# Altium project CMRat_GEN2.8.PrjPcb (part 2 of 2)

## Sheet PBC.SchDoc: =filename
size A4
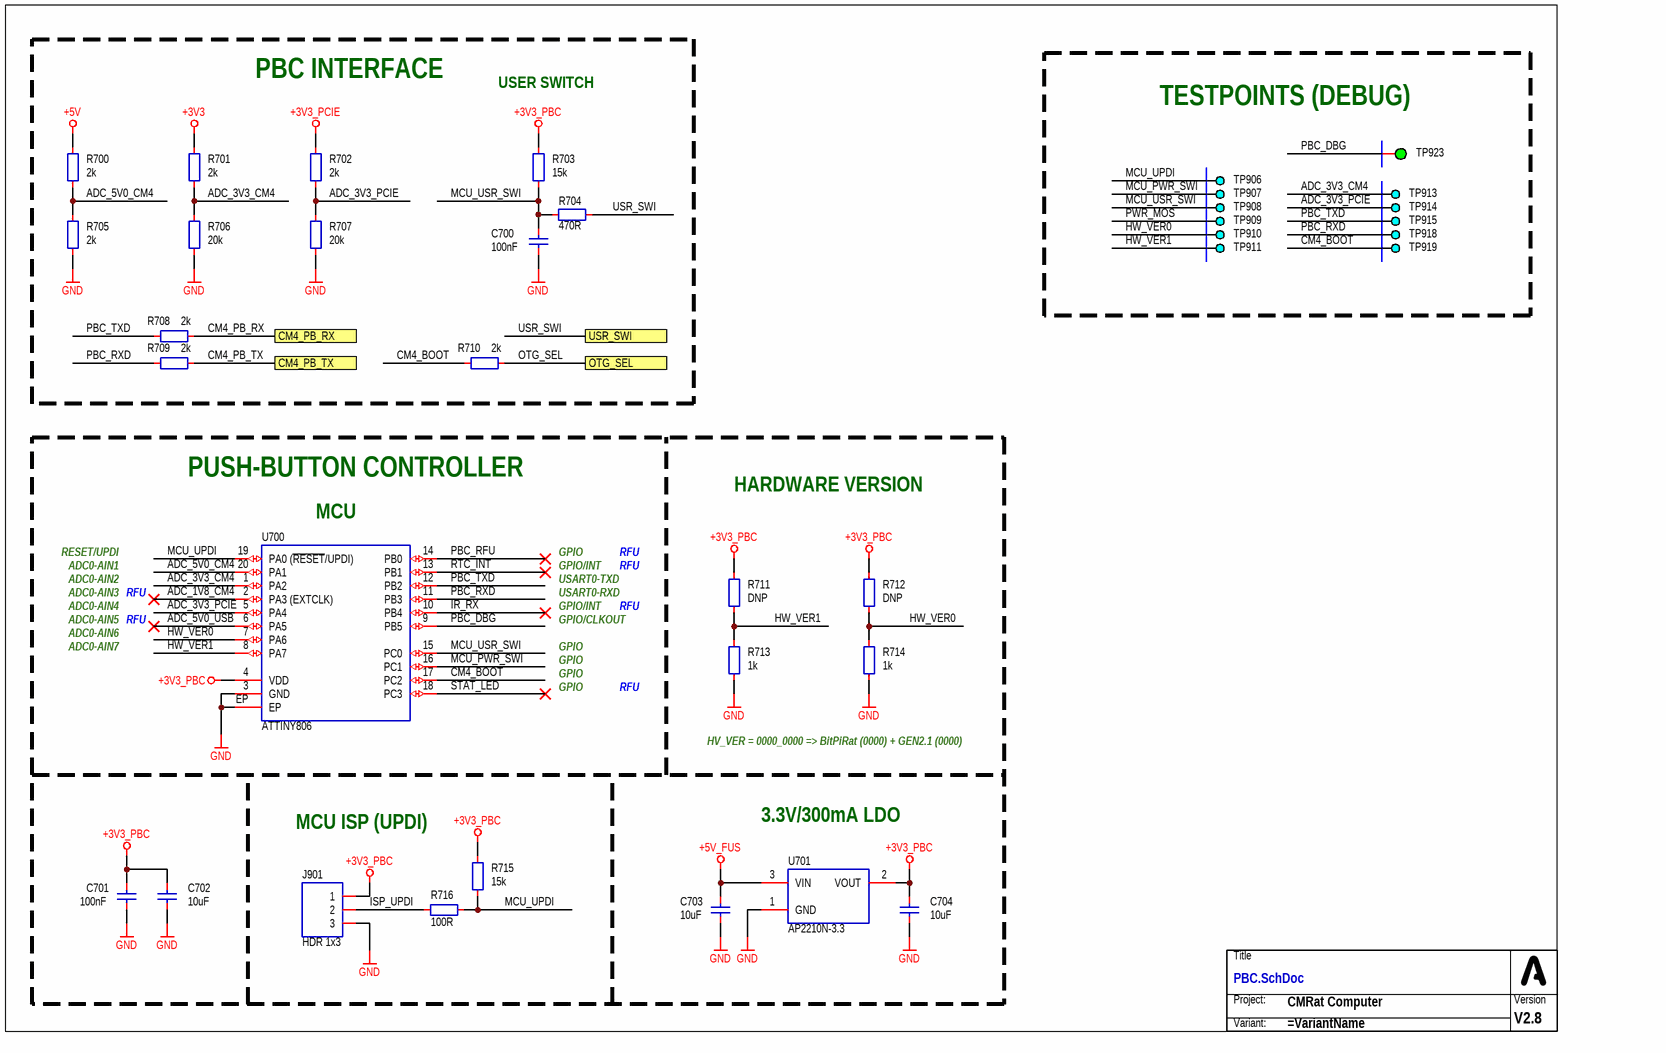
[diagram p10: PBC.SchDoc]

### Parts
C700  100nF  [CAP_0603_R]
C701  100nF  [CAP_0603_R]
C702  10uF  [CAP_0603_R]
C703  10uF  [CAP_0603_R]
C704  10uF  [CAP_0603_R]
J901  HDR 1x3  [CON_HDR_P254_1X03_STR]
R700  2k  [RES_0603_R]
R701  2k  [RES_0603_R]
R702  2k  [RES_0603_R]
R703  15k  [RES_0603_R]
R704  470R  [RES_0603_R]
R705  2k  [RES_0603_R]
R706  20k  [RES_0603_R]
R707  20k  [RES_0603_R]
R708  2k  [RES_0603_R]
R709  2k  [RES_0603_R]
R710  2k  [RES_0603_R]
R711  DNP  [RES_0603_R]
R712  DNP  [RES_0603_R]
R713  1k  [RES_0603_R]
R714  1k  [RES_0603_R]
R715  15k  [RES_0603_R]
R716  100R  [RES_0603_R]
TB700  (no value)  (no BOM)
TP906  DEBUG  [PCB_TP_DBG_50]  (value not drawn)  (no BOM)
TP907  DEBUG  [PCB_TP_DBG_50]  (value not drawn)  (no BOM)
TP908  DEBUG  [PCB_TP_DBG_50]  (value not drawn)  (no BOM)
TP909  DEBUG  [PCB_TP_DBG_50]  (value not drawn)  (no BOM)
TP910  DEBUG  [PCB_TP_DBG_50]  (value not drawn)  (no BOM)
TP911  DEBUG  [PCB_TP_DBG_50]  (value not drawn)  (no BOM)
TP913  DEBUG  [PCB_TP_DBG_50]  (value not drawn)  (no BOM)
TP914  DEBUG  [PCB_TP_DBG_50]  (value not drawn)  (no BOM)
TP915  DEBUG  [PCB_TP_DBG_50]  (value not drawn)  (no BOM)
TP918  DEBUG  [PCB_TP_DBG_50]  (value not drawn)  (no BOM)
TP919  DEBUG  [PCB_TP_DBG_50]  (value not drawn)  (no BOM)
TP923  ICT  [PCB_TP_ICT_100]  (value not drawn)  (no BOM)
U700  ATTINY806  [ICC_QFN20_300X300X90_P40_EP_R]
U701  AP2210N-3.3  [PKG_SOT23-3L_SC59_P190_R]

### Ports
CM4_PB_RX, CM4_PB_TX, OTG_SEL, USR_SWI

### Nets
+3V3: R701.1
+3V3_PBC: C701.2 C702.2 C704.2 J901.1 R703.2 R711.2 R712.2 R715.2 U700.4(VDD) U701.2(VOUT)
+3V3_PCIE: R702.1
+5V: R700.1
+5V_FUS: C703.2 U701.3(VIN)
GND: C700.1 C701.1 C702.1 C703.1 C704.1 J901.3 R705.2 R706.1 R707.1 R713.1 R714.1 U700.3(GND) U700.EP U701.1(GND)
ADC_1V8_CM4: U700.2(PA3_(EXTCLK))
ADC_3V3_CM4: R701.2 R706.2 TP913.1 U700.1(PA2)
ADC_3V3_PCIE: R702.2 R707.2 TP914.1 U700.5(PA4)
ADC_5V0_CM4: R700.2 R705.1 U700.20(PA1)
ADC_5V0_USB: U700.6(PA5)
CM4_BOOT: R710.2 TP919.1 U700.17(PC2)
CM4_PB_RX: R708.2 ; port CM4_PB_RX
CM4_PB_TX: R709.2 ; port CM4_PB_TX
HW_VER0: R712.1 R714.2 TP910.1 U700.7(PA6)
HW_VER1: R711.1 R713.2 TP911.1 U700.8(PA7)
IR_RX: U700.10(PB4)
ISP_UPDI: J901.2 R716.1
MCU_PWR_SWI: TP907.1 U700.16(PC1)
MCU_UPDI: R715.1 R716.2 TP906.1 U700.19(PA0_(~{RESET}/UPDI))
MCU_USR_SWI: C700.2 R703.1 R704.2 TP908.1 U700.15(PC0)
OTG_SEL: R710.1 ; port OTG_SEL
PBC_DBG: TP923.1 U700.9(PB5)
PBC_RFU: U700.14(PB0)
PBC_RXD: R709.1 TP918.1 U700.11(PB3)
PBC_TXD: R708.1 TP915.1 U700.12(PB2)
PWR_MOS: TP909.1
RTC_INT: U700.13(PB1)
STAT_LED: U700.18(PC3)
USR_SWI: R704.1 ; port USR_SWI

### Notes on the sheet
- PBC INTERFACE
- USER SWITCH
- (near TP923) TESTPOINTS (DEBUG)
- PUSH-BUTTON CONTROLLER
- (near U700) MCU
- HARDWARE VERSION
- RESET/UPDI
- ADC0-AIN1
- ADC0-AIN2
- USART0-TXD
- GPIO/INT
- GPIO
- RFU
- ADC0-AIN3
- ADC0-AIN4
- ADC0-AIN5
- ADC0-AIN6
- ADC0-AIN7
- USART0-RXD
- GPIO/CLKOUT
- HV_VER = 0000_0000 => BitPiRat (0000) + GEN2.1 (0000)
- MCU ISP (UPDI)
- 3.3V/300mA LDO
- (in symbol SCH_TITLE_BLOCK_SIMPLE_NODATE) Title; Project:; Version; Variant:

### Library data of the parts
C700 C701 = CAP-0008: Capacitor; MLCC; 100nF; 10V X5R; Manufacturer: YAGEO; MPN: CC0603KRX7R9BB104; Package (Case): 0603; Component Type: Capacitor; Component Subtype: MLCC; Value: 100nF; Mounting Type: SMD
C702-C704 = CAP-0023: CAP SMD 10u/10V ±10% 10V X5R (0603); Manufacturer: Samsung Electro-Mechanics; MPN: CL10A106KP8NNNC; Component Subtype: MLCC; Package (Case): 0603; Component Type: Capacitor; Value: 10uF; Mounting Type: SMD
J901 = CON_1X03_COL: CONN THT / HEADER / PITCH 2,54mm / VERTICAL / (3 PIN); Manufacturer: Ckmtw(Shenzhen Cankemeng); MPN: B-2100S03P-A110; Component Subtype: Pin Header; Value: HDR 1x3; Component Type: Connector; Mounting Type: THT; Package (Case): THT
R700-R702 R705 R708-R710 = RES-0033: Resistor; Thick Film; 2k2; 1%; 100mW; 100PPM; 75V; Standard; SMD; 0603 (1608);; Manufacturer: UNI-ROYAL(Uniroyal Elec); MPN: 0603WAF2001T5E; Package (Case): 0603; Component Type: Resistor; Component Subtype: Thick Film; Value: 2k; Mounting Type: SMD
R703 R715 = RES-0043: Resistor; Thick Film; 15k; 1%; 100mW; 100PPM; 75V; Standard; SMD; 0603 (1608);; Manufacturer: UNI-ROYAL(Uniroyal Elec); MPN: 0603WAF1502T5E; Package (Case): 0603; Component Type: Resistor; Component Subtype: Thick Film; Value: 15k; Mounting Type: SMD
R704 = RES-0042: Resistor; Thick Film; 470R; 1%; 100mW; 100PPM; 75V; Standard; SMD; 0603 (1608);; Manufacturer: UNI-ROYAL(Uniroyal Elec); MPN: 0603WAF4700T5E; Package (Case): 0603; Component Type: Resistor; Component Subtype: Thick Film; Value: 470R; Mounting Type: SMD
R706 R707 = RES-0054: Resistor; Thick Film; 20k; SMD; 0603 (1608);; Manufacturer: UNI-ROYAL(Uniroyal Elec); MPN: 0603WAF2002T5E; Package (Case): 0603; Component Type: Resistor; Component Subtype: Thick Film; Value: 20k; Mounting Type: SMD
R711 R712 = RES-0051: Component Subtype: Thick Film; Package (Case): 0603; Component Type: Resistor; Value: DNP; Mounting Type: SMD
R713 R714 = RES-0027: Resistor; Thick Film; 1k; 1%; 100mW; 100PPM; 75V; Standard; SMD; 0603 (1608);; Manufacturer: UNI-ROYAL(Uniroyal Elec); MPN: 0603WAF1001T5E; Package (Case): 0603; Component Type: Resistor; Component Subtype: Thick Film; Value: 1k; Mounting Type: SMD
R716 = RES-0026: Resistor; Thick Film; 100R; 1%; 100mW; 100PPM; 75V; Standard; SMD; 0603 (1608);; Manufacturer: UNI-ROYAL(Uniroyal Elec); MPN: 0603WAF1000T5E; Package (Case): 0603; Component Type: Resistor; Component Subtype: Thick Film; Value: 100R; Mounting Type: SMD
TB700 = SCH_TITLE_BLOCK_SIMPLE_NODATE
TP906-TP911 TP913-TP915 TP918 TP919 = PCB_TP_DBG: PCB Marking; Test Point (Debug);; Value: DEBUG; Component Type: Testpoint
TP923 = PCB_TP_ICT: Test Point (ICT); Component Type: Testpoint (for ICT); Mounting Type: Non component; Value: ICT
U700 = ICC_MCP_ATTINY406_806_1606_VQFN20: IC; MCU; tinyAVR 8-bit MCU, 20MHz, 8kB flash, 512B RAM, USART, SPI, TWI, VQFN package; Manufacturer: Microchip Technology (Atmel); MPN: ATTINY806-MNR; Package (Case): VQFN20; Component Type: IC; Mounting Type: SMD; Value: ATTINY806
U701 = ICC_DIO_AP2210N-3.3TR: ICC; LDO regulator; AP2210N-3.3, Ultra-low dropout voltage regulator, Vout = 3.3V, 300 mA, SOT23-3 package; Manufacturer: Diodes Incorporated; MPN: AP2210N-3.3TRG1; Component Type: IC; Mounting Type: SMD; Value: AP2210N-3.3; Package (Case): SOT23-3

## Nets that join several sheets
+1V8: CM_MODULE (MOD100.88 MOD100.90), PWR (TP924.1)
+3V3: CM_MODULE (J100.1 MOD100.78 MOD100.84 MOD100.86), USB_C (SW200.3), Ethernet (J500.15 J500.17), SD (R600.2), PWR (TP922.1), MISC (5 pins), HDMI (R400.2), PBC (R701.1)
+3V3_PBC: PWR (TP904.1 TP905.1), PBC (10 pins)
+3V3_PCIE: PCIe (17 pins), PWR (7 pins), PBC (R702.1)
+5V: CM_MODULE (9 pins), PWR (14 pins), MISC (Q803.1 R807.2), HDMI (R401.2), PBC (R700.1)
+5V_FUS: PWR (9 pins), PBC (C703.2 U701.3)
+5V_IN: USB_C (J201.1 R204.2 U201.5), PWR (7 pins)
+12V_AUX: PWR (6 pins), MISC (R803.2)
+12V_IN: PWR (5 pins), MISC (R806.2)
GND: CM_MODULE (56 pins), PCIe (22 pins), USB_C (16 pins), Ethernet (6 pins), SD (6 pins), PWR (41 pins), MISC (8 pins), HDMI (11 pins), PBC (14 pins)
POE_A1: Ethernet (J500.11), PWR (MOD900.1)
POE_A2: Ethernet (J500.12), PWR (MOD900.2)
POE_B1: Ethernet (J500.13), PWR (MOD900.3)
POE_B2: Ethernet (J500.14), PWR (MOD900.4)
BOOT_MODE: CM_MODULE (MOD100.93), USB_C (Q200.3)
CM4_PB_RX: CM_MODULE (MOD100.34), PBC (R708.2)
CM4_PB_TX: CM_MODULE (MOD100.54), PBC (R709.2)
CM_GPIO26: CM_MODULE (MOD100.24), USB_C (R207.1)
CM_HDMI0_CEC: CM_MODULE (MOD100.151), HDMI (J400.14)
CM_HDMI0_CLK_N: CM_MODULE (MOD100.190), HDMI (C403.1)
CM_HDMI0_CLK_P: CM_MODULE (MOD100.188), HDMI (C402.1)
CM_HDMI0_D0_N: CM_MODULE (MOD100.184), HDMI (C407.1)
CM_HDMI0_D0_P: CM_MODULE (MOD100.182), HDMI (C406.1)
CM_HDMI0_D1_N: CM_MODULE (MOD100.178), HDMI (C401.1)
CM_HDMI0_D1_P: CM_MODULE (MOD100.176), HDMI (C400.1)
CM_HDMI0_D2_N: CM_MODULE (MOD100.172), HDMI (C405.1)
CM_HDMI0_D2_P: CM_MODULE (MOD100.170), HDMI (C404.1)
CM_HDMI0_HPD: CM_MODULE (MOD100.153), HDMI (J400.19)
CM_HDMI0_SCL: CM_MODULE (MOD100.200), HDMI (J400.15)
CM_HDMI0_SDA: CM_MODULE (MOD100.199), HDMI (J400.16)
CM_I2C_SCL: CM_MODULE (J100.4 MOD100.56), MISC (U801.2)
CM_I2C_SDA: CM_MODULE (J100.3 MOD100.58), MISC (U801.1)
CM_nACT: CM_MODULE (MOD100.21), MISC (Q800.1)
CM_nPWR: CM_MODULE (MOD100.95), MISC (Q801.1)
CM_SD_CLK: CM_MODULE (MOD100.57), SD (J600.5 TP602.1)
CM_SD_CMD: CM_MODULE (MOD100.62), SD (J600.3 TP600.1)
CM_SD_DAT0: CM_MODULE (MOD100.63), SD (J600.7)
CM_SD_DAT1: CM_MODULE (MOD100.67), SD (J600.8)
CM_SD_DAT2: CM_MODULE (MOD100.69), SD (J600.1)
CM_SD_DAT3: CM_MODULE (MOD100.61), SD (J600.2)
CM_USB_D_N: CM_MODULE (MOD100.103), USB_C (J200.A7 J200.B7 U200.2 U200.9)
CM_USB_D_P: CM_MODULE (MOD100.105), USB_C (J200.A6 J200.B6 U200.1 U200.10)
CM_USB_OTG: CM_MODULE (MOD100.101), USB_C (R200.1 R202.2 TP200.1)
ETH_D0_N: CM_MODULE (MOD100.10), Ethernet (J500.2 U501.2 U501.9)
ETH_D0_P: CM_MODULE (MOD100.12), Ethernet (J500.1 U501.1 U501.10)
ETH_D1_N: CM_MODULE (MOD100.6), Ethernet (J500.6 U501.5 U501.6)
ETH_D1_P: CM_MODULE (MOD100.4), Ethernet (J500.3 U501.4 U501.7)
ETH_D2_N: CM_MODULE (MOD100.9), Ethernet (J500.8 U500.2 U500.9)
ETH_D2_P: CM_MODULE (MOD100.11), Ethernet (J500.7 U500.1 U500.10)
ETH_D3_N: CM_MODULE (MOD100.5), Ethernet (J500.10 U500.5 U500.6)
ETH_D3_P: CM_MODULE (MOD100.3), Ethernet (J500.9 U500.4 U500.7)
ETH_LED_nACT: CM_MODULE (MOD100.15), Ethernet (R500.1)
ETH_LED_nSPD: CM_MODULE (MOD100.17), Ethernet (R501.1)
LED_ACT_OUT: CM_MODULE (J100.17), MISC (Q800.3 R800.2)
LED_PWR_OUT: CM_MODULE (J100.18), MISC (Q801.3 R802.2)
MCU_PWR_SWI: PWR (Q902.1), PBC (TP907.1 U700.16)
OTG_SEL: USB_C (Q200.1 R200.2 SW200.2 TP201.1), PBC (R710.1)
PCIe_CLK_N: CM_MODULE (MOD100.112), PCIe (J300.53)
PCIe_CLK_P: CM_MODULE (MOD100.110), PCIe (J300.55)
PCIe_nCLKREQ: CM_MODULE (MOD100.102), PCIe (J300.52 TP301.1)
PCIe_nRST: CM_MODULE (MOD100.109), PCIe (J300.50 TP300.1)
PCIe_RX_N: CM_MODULE (MOD100.118), PCIe (J300.41)
PCIe_RX_P: CM_MODULE (MOD100.116), PCIe (J300.43)
PCIe_TX_N: CM_MODULE (MOD100.124), PCIe (J300.47)
PCIe_TX_P: CM_MODULE (MOD100.122), PCIe (J300.49)
PWR_MOS: PWR (6 pins), PBC (TP909.1)
SD_CARD_DET: CM_MODULE (MOD100.76), SD (J601.1 TP605.1)
USER1_LED: CM_MODULE (MOD100.46), MISC (R804.1)
USER2_LED: CM_MODULE (MOD100.48), MISC (R805.1)
USR_SWI: CM_MODULE (J100.19), PBC (R704.1)

## Assembly variants
FULL: not fitted C907 MOD300 R204 R711 R712 R806 R807; alternate parts C404 -> ITEM_R10045, C406 -> ITEM_R10045, C405 -> ITEM_R10045, C407 -> ITEM_R10045, C400 -> ITEM_R10045, C401 -> ITEM_R10045, C402 -> ITEM_R10045, C403 -> ITEM_R10045